# Altium schematic sheet BatteruPSU_SM-reg.SchDoc
size A4
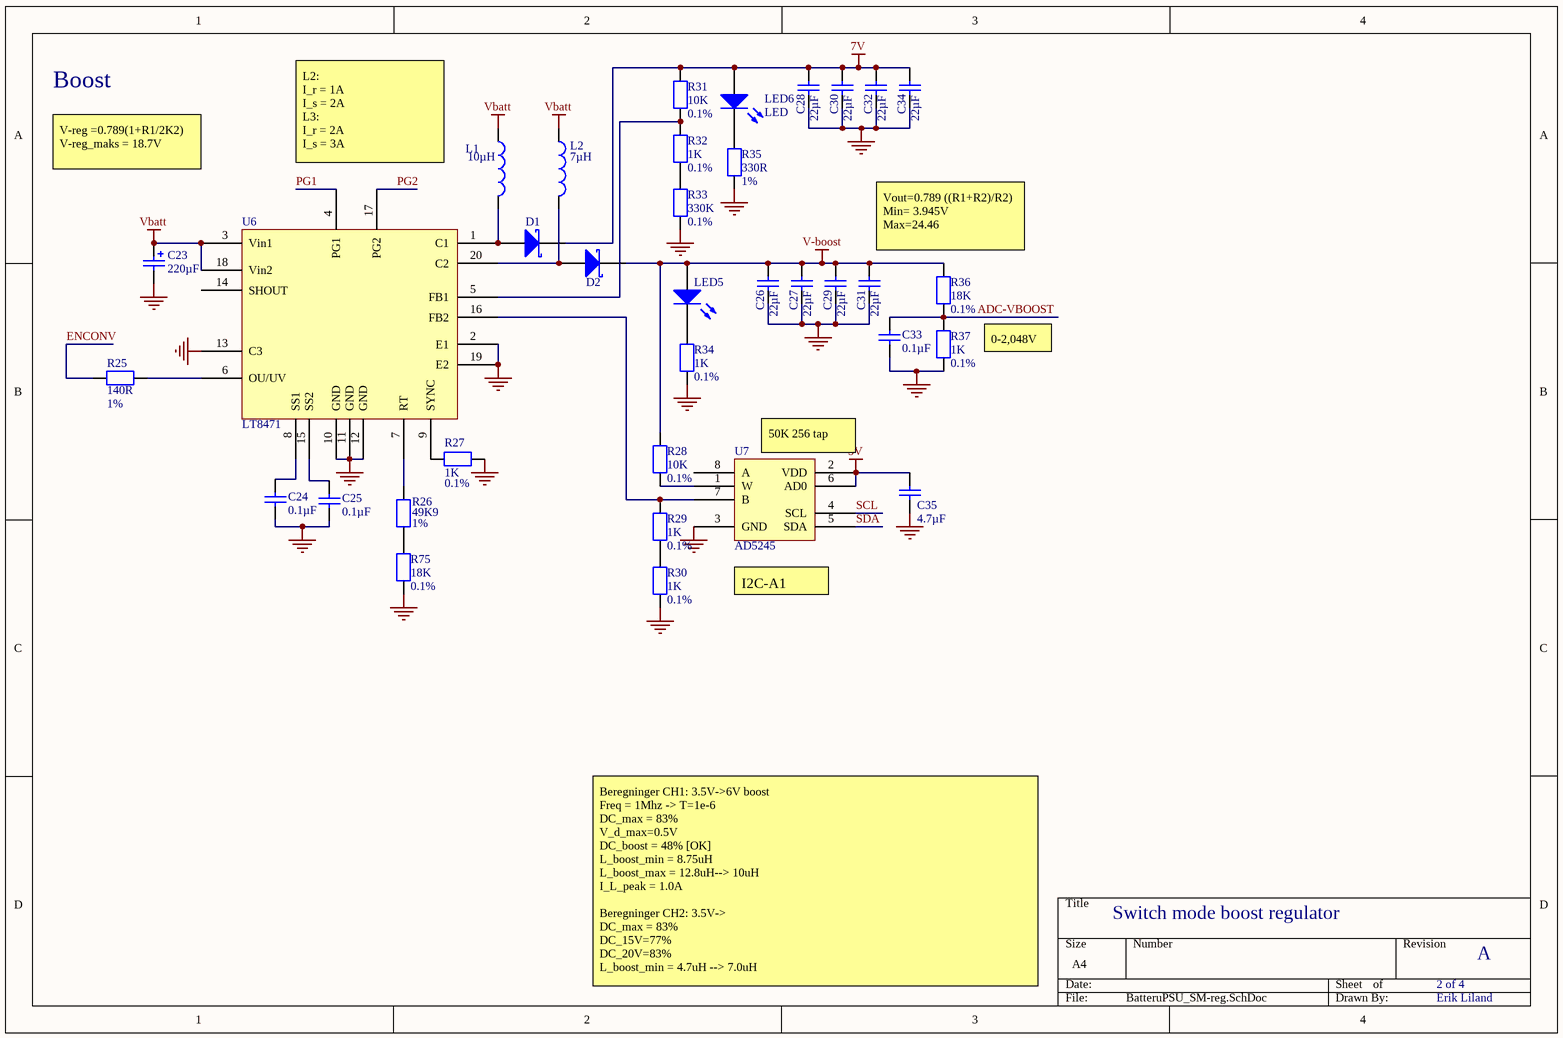
[diagram p0: BatteruPSU_SM-reg.SchDoc]

## Parts
C23  220µF  [CAP SMD (F)]
C24  0.1µF  [0805_N_CAP]
C25  0.1µF  [0805_N_CAP]
C26  22µF  [0805_N_CAP]
C27  22µF  [0805_N_CAP]
C28  22µF  [0805_N_CAP]
C29  22µF  [0805_N_CAP]
C30  22µF  [0805_N_CAP]
C31  22µF  [0805_N_CAP]
C32  22µF  [0805_N_CAP]
C33  0.1µF  [0805_N_CAP]
C34  22µF  [0805_N_CAP]
C35  4.7µF  [0805_N_CAP]
D1  D Schottky  [DO-214AC, SMA]  (value not drawn)
D2  D Schottky  [DO-214AC, SMA]  (value not drawn)
L1  Inductance: 10µH  [Inductor wirewound]  (hidden comment: Inductor)
L2  Inductance: 7µH  [Inductor wirewound]  (hidden comment: Inductor)
LED5  LED  [0805_N_LED]  (value not drawn)
LED6  LED  [0805_N_LED]
R25  140R  Tolerance: 1%  [0805_N_RES]
R26  49K9  Tolerance: 1%  [0805_N_RES]
R27  1K  Tolerance: 0.1%  [0805_N_RES]
R28  10K  Tolerance: 0.1%  [0805_N_RES]
R29  1K  Tolerance: 0.1%  [0805_N_RES]
R30  1K  Tolerance: 0.1%  [0805_N_RES]
R31  10K  Tolerance: 0.1%  [0805_N_RES]
R32  1K  Tolerance: 0.1%  [0805_N_RES]
R33  330K  Tolerance: 0.1%  [0805_N_RES]
R34  1K  Tolerance: 0.1%  [0805_N_RES]
R35  330R  Tolerance: 1%  [0805_N_RES]
R36  18K  Tolerance: 0.1%  [0805_N_RES]
R37  1K  Tolerance: 0.1%  [0805_N_RES]
R75  18K  Tolerance: 0.1%  [0805_N_RES]
U6  LT8471  [TSSOP20_N]
U7  AD5245  [SOT-23-8]

## Nets
5V: C35.1 U7.2(VDD) U7.6(AD0)
7V: C28.1 C30.1 C32.1 C34.1 D1.2(K) LED6.1(A) R31.2
GND: C23.2 C24.1 C25.1 C26.2 C27.2 C28.2 C29.2 C30.2 C31.2 C32.2 C33.1 C34.2 C35.2 R27.2 R30.1 R33.2 R34.1 R35.2 R37.2 R75.2 U6.2(E1) U6.10(GND) U6.11(GND) U6.12(GND) U6.13(C3) U6.19(E2) U7.3(GND)
V-boost: C26.1 C27.1 C29.1 C31.1 D2.2(K) LED5.1(A) R28.2 R36.1
Vbatt: C23.1 L1.1 L2.1 U6.3(Vin1) U6.18(Vin2)
ADC-VBOOST: C33.2 R36.2 R37.1
ENCONV: R25.1
PG1: U6.4(PG1)
PG2: U6.17(PG2)
SCL: U7.4(SCL)
SDA: U7.5(SDA)
NetC24_2: C24.2 U6.8(SS1)
NetC25_2: C25.2 U6.15(SS2)
NetD1_1: D1.1(A) L1.2 U6.1(C1)
NetD2_1: D2.1(A) L2.2 U6.20(C2)
NetLED5_2: LED5.2(K) R34.2
NetLED6_2: LED6.2(K) R35.1
NetR25_2: R25.2 U6.6(OU/UV)
NetR26_1: R26.1 R75.1
NetR26_2: R26.2 U6.7(RT)
NetR27_1: R27.1 U6.9(SYNC)
NetR28_1: R28.1 U7.1(W)
NetR29_1: R29.1 R30.2
NetR29_2: R29.2 U6.16(FB2) U7.7(B)
NetR31_1: R31.1 R32.2 U6.5(FB1)
NetR32_1: R32.1 R33.1

Not connected (* = marked no-connect by the designer): U6 14(SHOUT); U7 8(A)

## Notes on the sheet
- Boost
- V-reg =0.789(1+R1/2K2)
  V-reg_maks = 18.7V
- L2:
  I_r = 1A
  I_s = 2A
  L3:
  I_r = 2A
  I_s = 3A
- Vout=0.789 ((R1+R2)/R2)
  Min= 3.945V
  Max=24.46
- 0-2,048V
- (near U7) 50K 256 tap
- (near U7) I2C-A1
- Switch mode boost regulator
- Beregninger CH1: 3.5V->6V boost
  Freq = 1Mhz -> T=1e-6
  DC_max = 83%
  V_d_max=0.5V
  DC_boost = 48%	[OK]
  L_boost_min = 8.75uH
  L_boost_max = 12.8uH--> 10uH
  I_L_peak = 1.0A
  Beregninger CH2: 3.5V->
  DC_max = 83%
  DC_15V=77%
  DC_20V=83%
  L_boost_min = 4.7uH --> 7.0uH
- 2 of 4
- A
- Erik Liland

## Library data of the parts
C23 = Cap Pol: Polarized Capacitor; Manufacturer: Panasonic Electronic Components; Manufacturer Part Number: EEH-ZA1E221P; Tolerance: ±20%; ESR (Equivalent Series Resistance): 27 mOhm; Lifetime @ Temp.: 10000 Hrs @ 105°C; Type: Polymer - Hybrid; Ripple Current: 2.3A; Surface Mount Land Size: 0.327" L x 0.327" W (8.30mm x 8.30mm); Voltage - Rated: 25V; Supplier 1: Digi-Key; Supplier Part Number 1: P15437CT-ND; RoHS: RoHS Compliant; Category: Capacitors; Stock 1: 3490; Pricing 1: 1=2.68, 10=2.221, 25=2.1228, 50=2.0572, 100=1.9594, 250=1.82872 (EUR); Packaging: Cut Tape (CT); Capacitance: 220µF; Operating Temperature: -55°C ~ 105°C; Size / Dimension: 0.315" Dia (8.00mm); Height - Seated (Max): 0.413" (10.50mm); Mounting Type: Surface Mount; Package / Case: Radial, Can - SMD; ComponentLink1URL: http://industrial.panasonic.com/www-data/pdf/ABA0000/ABA0000CE136.pdf; ComponentLink1Description: http://industrial.panasonic.com/www-data/pdf/ABA0000/ABA0000CE136.pdf
C24 C25 C33 = Cap: Capacitor; Manufacturer: Kemet; Manufacturer Part Number: C0805C104K4RACTU; Temperature Coefficient: X7R; Tolerance: ±10%; Voltage - Rated: 16V; Capacitance: 0.1µF; Category: Capacitors; ComponentLink1Description: http://www.kemet.com/docfinder?Partnumber=C0805C104K4RACTU; ComponentLink1URL: http://www.kemet.com/docfinder?Partnumber=C0805C104K4RACTU; Height - Seated (Max): -; Mounting Type: Surface Mount, MLCC; Operating Temperature: -55°C ~ 125°C; Package / Case: 0805 (2012 Metric); Packaging: Cut Tape (CT); Pricing 1: 1=0.11, 10=0.076, 50=0.0436, 100=0.0359, 250=0.03024, 500=0.02534, 1000=0.02081 (EUR); RoHS: RoHS Compliant; Size / Dimension: 0.079" L x 0.049" W (2.00mm x 1.25mm); Stock 1: 286232; Supplier 1: Digi-Key; Supplier Part Number 1: 399-1167-1-ND; Thickness (Max): 0.035" (0.88mm)
C26 C27 C29 C31 = Cap: Capacitor; Manufacturer: TDK Corporation; Manufacturer Part Number: C2012X5R1V226M125AC; Tolerance: ±20%; Voltage - Rated: 35V; Temperature Coefficient: X5R; Supplier 1: Digi-Key; Supplier Part Number 1: 445-14428-1-ND; RoHS: RoHS Compliant; Category: Capacitors; Stock 1: 68492; Pricing 1: 1=1.19, 10=0.996, 100=0.6357, 250=0.52976, 500=0.47676, 1000=0.42586 (EUR); Packaging: Cut Tape (CT); Capacitance: 22µF; Mounting Type: Surface Mount, MLCC; Operating Temperature: -55°C ~ 85°C; Package / Case: 0805 (2012 Metric); Size / Dimension: 0.079" L x 0.049" W (2.00mm x 1.25mm); Height - Seated (Max): -; Thickness (Max): 0.057" (1.45mm); ComponentLink1URL: http://product.tdk.com/en/catalog/datasheets/mlcc_commercial_general_en.pdf; ComponentLink1Description: http://product.tdk.com/en/catalog/datasheets/mlcc_commercial_general_en.pdf
C28 C30 C32 C34 = Cap: Capacitor; Manufacturer: Murata Electronics North America; Manufacturer Part Number: GRM21BR61A226ME51L; Tolerance: ±20%; Voltage - Rated: 10V; Temperature Coefficient: X5R; Supplier 1: Digi-Key; Supplier Part Number 1: 490-10511-1-ND; RoHS: RoHS Compliant; Category: Capacitors; Stock 1: 429; Pricing 1: 1=0.26, 10=0.212, 25=0.1452, 50=0.119, 100=0.1056, 250=0.07924, 500=0.07, 1000=0.06207 (EUR); Packaging: Cut Tape (CT); Capacitance: 22µF; Mounting Type: Surface Mount, MLCC; Operating Temperature: -55°C ~ 85°C; Package / Case: 0805 (2012 Metric); Size / Dimension: 0.079" L x 0.049" W (2.00mm x 1.25mm); Height - Seated (Max): -; Thickness (Max): 0.055" (1.40mm); ComponentLink1URL: http://www.murata.com/~/media/webrenewal/support/library/catalog/products/capacitor/mlcc/c02e.ashx; ComponentLink1Description: http://www.murata.com/~/media/webrenewal/support/library/catalog/products/capacitor/mlcc/c02e.ashx
C35 = Cap: Capacitor; Manufacturer: Samsung Electro-Mechanics America, Inc; Manufacturer Part Number: CL21B475KOFNFNE; Tolerance: ±10%; Voltage - Rated: 16V; Temperature Coefficient: X7R; Supplier 1: Digi-Key; Supplier Part Number 1: 1276-2970-1-ND; RoHS: RoHS Compliant; Category: Capacitors; Stock 1: 58798; Pricing 1: 1=0.27, 10=0.18, 25=0.1308, 100=0.0915, 500=0.06538, 1000=0.05557 (EUR); Packaging: Cut Tape (CT); Capacitance: 4.7µF; Mounting Type: Surface Mount, MLCC; Operating Temperature: -55°C ~ 125°C; Package / Case: 0805 (2012 Metric); Size / Dimension: 0.079" L x 0.049" W (2.00mm x 1.25mm); Height - Seated (Max): -; Thickness (Max): 0.053" (1.35mm); ComponentLink1URL: http://www.samsungsem.com/kr/front/downloadcms.do?path=/kr/support/product-search/mlcc/__icsFiles/afieldfile/2014/11/05&fileName=S_CL21B475KOFNFNE.pdf; ComponentLink1Description: http://www.samsungsem.com/kr/front/downloadcms.do?path=/kr/support/product-search/mlcc/__icsFiles/afieldfile/2014/11/05&fileName=S_CL21B475KOFNFNE.pdf
D1 D2 = D Schottky: Schottky Diode; Manufacturer: Micro Commercial Co; Manufacturer Part Number: SK33A-TP; Voltage - DC Reverse (Vr) (Max): 30V; Current - Average Rectified (Io): 3A; Voltage - Forward (Vf) (Max) @ If: 500mV @ 3A; Speed: Fast Recovery =< 500ns, > 200mA (Io); Current - Reverse Leakage @ Vr: 500µA @ 30V; Capacitance @ Vr, F: 250pF @ 4V, 1MHz; Supplier 1: Digi-Key; Supplier Part Number 1: SK33A-TPCT-ND; RoHS: RoHS Compliant; Category: Discrete Semiconductor Products; Stock 1: 4384; Pricing 1: 1=0.57, 10=0.403, 25=0.3316, 100=0.2649, 250=0.19304, 500=0.15676, 1000=0.1205 (EUR); Packaging: Cut Tape (CT); Diode Type: Schottky; Reverse Recovery Time (trr): -; Mounting Type: Surface Mount; Package / Case: DO-214AC, SMA; Supplier Device Package: DO-214AC (HSMA); Operating Temperature - Junction: -50°C ~ 125°C; ComponentLink1URL: http://www.mccsemi.com/up_pdf/SK32A-SK310A(HSMA).PDF; ComponentLink1Description: http://www.mccsemi.com/up_pdf/SK32A-SK310A(HSMA).PDF; Published: 8-Jun-2000; LatestRevisionDate: 17-Jul-2002; LatestRevisionNote: Re-released for DXP Platform.; PackageReference: SMB; Publisher: Altium Limited; PackageDescription: DO-214-AA/SMB; 2 C-Bend Leads; Body 5.3 x 3.6 mm, inc. leads (LxW); Code_JEDEC: DO-214-AA
L1 = Inductor: Manufacturer: Bourns Inc.; Manufacturer Part Number: SRR1005-100M; Value: 11uH; Type: Wirewound; Material - Core: Ferrite; Tolerance: ±20%; Current Rating: 2A; Current - Saturation: 3A; Shielding: Shielded; DC Resistance (DCR): 65 mOhm Max; Q @ Freq: 48 @ 2.52MHz; Frequency - Self Resonant: 30MHz; Frequency - Test: 1kHz; Supplier 1: Digi-Key; Supplier Part Number 1: SRR1005-100MCT-ND; RoHS: RoHS Compliant; Category: Inductors, Coils, Chokes; Stock 1: 2322; Pricing 1: 1=0.91, 10=0.854, 25=0.798, 50=0.6838, 100=0.6496, 250=0.59264 (EUR); Packaging: Cut Tape (CT); Operating Temperature: -40°C ~ 125°C; Mounting Type: Surface Mount; Package / Case: Nonstandard; Size / Dimension: 0.500" L x 0.394" W (12.70mm x 10.00mm); Height - Seated (Max): 0.205" (5.20mm); Supplier Device Package: -; ComponentLink1URL: http://www.bourns.com/data/global/pdfs/SRR1005.pdf; ComponentLink1Description: http://www.bourns.com/data/global/pdfs/SRR1005.pdf
L2 = Inductor: Manufacturer: Bourns Inc.; Manufacturer Part Number: SRR1005-7R0M; Type: Wirewound; Material - Core: Ferrite; Tolerance: ±20%; Current Rating: 2.2A; Current - Saturation: 3.2A; Shielding: Shielded; DC Resistance (DCR): 55 mOhm Max; Q @ Freq: 22 @ 7.96MHz; Frequency - Self Resonant: 32MHz; Frequency - Test: 1kHz; Supplier 1: Digi-Key; Supplier Part Number 1: SRR1005-7R0MCT-ND; RoHS: RoHS Compliant; Category: Inductors, Coils, Chokes; Stock 1: 0; Pricing 1: 1=0 (EUR); Packaging: Cut Tape (CT); Operating Temperature: -40°C ~ 125°C; Mounting Type: Surface Mount; Package / Case: Nonstandard; Size / Dimension: 0.500" L x 0.394" W (12.70mm x 10.00mm); Height - Seated (Max): 0.205" (5.20mm); Supplier Device Package: -; ComponentLink1URL: http://www.bourns.com/data/global/pdfs/SRR1005.pdf; ComponentLink1Description: http://www.bourns.com/data/global/pdfs/SRR1005.pdf
LED5 LED6 = LED: Typical RED, GREEN, YELLOW, AMBER; Manufacturer: OSRAM Opto Semiconductors Inc; Manufacturer Part Number: LG R971-KN-1; Wavelength - Dominant: 570nm; Wavelength - Peak: 572nm; Millicandela Rating: 26.05mcd; Voltage - Forward (Vf) (Typ): 2.2V; Current - Test: 20mA; Viewing Angle: 160°; Lens Style/Size: Rectangle with Flat Top, 1.30mm x 1.25mm; Lens Transparency: Diffused; Lens Color: White; Supplier 1: Digi-Key; Supplier Part Number 1: 475-1410-1-ND; RoHS: RoHS Compliant; Category: Optoelectronics; Stock 1: 152991; Pricing 1: 1=0.1, 10=0.087, 100=0.0691, 250=0.06048, 500=0.05526 (EUR); Packaging: Cut Tape (CT); Color: Green; Package / Case: 0805 (2012 Metric); Size / Dimension: 2.00mm L x 1.25mm W; Mounting Type: Surface Mount; ComponentLink1URL: http://www.osram-os.com/Graphics/XPic9/00078860_0.pdf; ComponentLink1Description: http://www.osram-os.com/Graphics/XPic9/00078860_0.pdf; Supplier Device Package: *; Height (Max): 0.90mm
R25 = Res: Resistor; Manufacturer: Samsung Electro-Mechanics America, Inc; Manufacturer Part Number: RC2012F1400CS; Power (Watts): 0.125W, 1/8W; Resistance (Ohms): 140; Temperature Coefficient: ±100ppm/°C; Value: 140R; Category: Resistors; ComponentLink1Description: http://www.samsungsem.com/global/support/library/product-catalog/__icsFiles/afieldfile/2015/01/12/CHIP_RESISTOR_150112_1.pdf; ComponentLink1URL: http://www.samsungsem.com/global/support/library/product-catalog/__icsFiles/afieldfile/2015/01/12/CHIP_RESISTOR_150112_1.pdf; Composition: Thick Film; Height: 0.024" (0.60mm); Number of Terminations: 2; Operating Temperature: -55°C ~ 155°C; Package / Case: 0805 (2012 Metric); Packaging: Cut Tape (CT); Pricing 1: 1=0.1, 10=0.022, 25=0.016, 100=0.0092, 500=0.00558, 1000=0.00411, 2500=0.00358 (EUR); RoHS: RoHS Compliant; Size / Dimension: 0.079" L x 0.049" W (2.00mm x 1.25mm); Stock 1: 7060; Supplier 1: Digi-Key; Supplier Device Package: 0805 (2012 Metric); Supplier Part Number 1: 1276-5229-1-ND
R26 = Res: Resistor; Manufacturer: Samsung Electro-Mechanics America, Inc; Manufacturer Part Number: RC2012F4992CS; Resistance (Ohms): 49.9k; Power (Watts): 0.125W, 1/8W; Temperature Coefficient: ±100ppm/°C; Value: 49K9; Supplier 1: Digi-Key; Supplier Part Number 1: 1276-5378-1-ND; RoHS: RoHS Compliant; Category: Resistors; Stock 1: 1527; Pricing 1: 1=0.1, 10=0.022, 25=0.016, 100=0.0092, 500=0.00558, 1000=0.00411, 2500=0.00358 (EUR); Packaging: Cut Tape (CT); Composition: Thick Film; Operating Temperature: -55°C ~ 155°C; Package / Case: 0805 (2012 Metric); Supplier Device Package: 0805 (2012 Metric); Size / Dimension: 0.079" L x 0.049" W (2.00mm x 1.25mm); Height: 0.024" (0.60mm); Number of Terminations: 2; ComponentLink1URL: http://www.samsungsem.com/global/support/library/product-catalog/__icsFiles/afieldfile/2015/01/12/CHIP_RESISTOR_150112_1.pdf; ComponentLink1Description: http://www.samsungsem.com/global/support/library/product-catalog/__icsFiles/afieldfile/2015/01/12/CHIP_RESISTOR_150112_1.pdf
R27 R29 R30 R32 R34 R37 = Res: Resistor; Manufacturer: Panasonic Electronic Components; Manufacturer Part Number: ERA-6AEB102V; Power (Watts): 0.125W, 1/8W; Temperature Coefficient: ±25ppm/°C; Value: 1K; Category: Resistors; ComponentLink1Description: http://industrial.panasonic.com/www-cgi/jvcr13pz.cgi?E+PZ+3+AOA0026+ERA6AEB102V+7+WW; ComponentLink1URL: http://industrial.panasonic.com/www-cgi/jvcr13pz.cgi?E+PZ+3+AOA0026+ERA6AEB102V+7+WW; Composition: Thin Film; Height: 0.024" (0.60mm); Number of Terminations: 2; Operating Temperature: -55°C ~ 155°C; Package / Case: 0805 (2012 Metric); Packaging: Cut Tape (CT); Pricing 1: 1=0.64, 50=0.2516, 100=0.194, 250=0.15092, 500=0.10636, 1000=0.07761 (EUR); Resistance (Ohms): 1k; RoHS: RoHS Compliant; Size / Dimension: 0.079" L x 0.049" W (2.00mm x 1.25mm); Stock 1: 142110; Supplier 1: Digi-Key; Supplier Device Package: 0805; Supplier Part Number 1: P1.0KDACT-ND
R28 R31 = Res: Resistor; Manufacturer: TE Connectivity AMP Connectors; Manufacturer Part Number: 8-1614884-4; Power (Watts): 0.1W, 1/10W; Temperature Coefficient: ±25ppm/°C; Value: 10K; Category: Resistors; ComponentLink1Description: http://www.te.com/commerce/DocumentDelivery/DDEController?Action=srchrtrv&DocNm=1773200&DocType=DS&DocLang=English; ComponentLink1URL: http://www.te.com/commerce/DocumentDelivery/DDEController?Action=srchrtrv&DocNm=1773200&DocType=DS&DocLang=English; Composition: Thin Film; Height: 0.026" (0.65mm); Number of Terminations: 2; Operating Temperature: -55°C ~ 155°C; Package / Case: 0805 (2012 Metric); Packaging: Cut Tape (CT); Pricing 1: 1=0.18, 100=0.1714, 500=0.16136 (EUR); Resistance (Ohms): 10k; RoHS: RoHS Compliant; Size / Dimension: 0.079" L x 0.049" W (2.00mm x 1.25mm); Stock 1: 18690; Supplier 1: Digi-Key; Supplier Device Package: 0805; Supplier Part Number 1: A103142CT-ND
R33 = Res: Resistor; Manufacturer: TE Connectivity AMP Connectors; Manufacturer Part Number: 8-1614884-4; Value: 10K; Power (Watts): 0.1W, 1/10W; Temperature Coefficient: ±25ppm/°C; Category: Resistors; ComponentLink1Description: http://www.te.com/commerce/DocumentDelivery/DDEController?Action=srchrtrv&DocNm=1773200&DocType=DS&DocLang=English; ComponentLink1URL: http://www.te.com/commerce/DocumentDelivery/DDEController?Action=srchrtrv&DocNm=1773200&DocType=DS&DocLang=English; Composition: Thin Film; Height: 0.026" (0.65mm); Number of Terminations: 2; Operating Temperature: -55°C ~ 155°C; Package / Case: 0805 (2012 Metric); Packaging: Cut Tape (CT); Pricing 1: 1=0.18, 100=0.1714, 500=0.16136 (EUR); Resistance (Ohms): 10k; RoHS: RoHS Compliant; Size / Dimension: 0.079" L x 0.049" W (2.00mm x 1.25mm); Stock 1: 18690; Supplier 1: Digi-Key; Supplier Device Package: 0805; Supplier Part Number 1: A103142CT-ND
R35 = Res: Resistor; Manufacturer: Samsung Electro-Mechanics America, Inc; Manufacturer Part Number: RC2012F1400CS; Value: 140R; Power (Watts): 0.125W, 1/8W; Resistance (Ohms): 140; Temperature Coefficient: ±100ppm/°C; Category: Resistors; ComponentLink1Description: http://www.samsungsem.com/global/support/library/product-catalog/__icsFiles/afieldfile/2015/01/12/CHIP_RESISTOR_150112_1.pdf; ComponentLink1URL: http://www.samsungsem.com/global/support/library/product-catalog/__icsFiles/afieldfile/2015/01/12/CHIP_RESISTOR_150112_1.pdf; Composition: Thick Film; Height: 0.024" (0.60mm); Number of Terminations: 2; Operating Temperature: -55°C ~ 155°C; Package / Case: 0805 (2012 Metric); Packaging: Cut Tape (CT); Pricing 1: 1=0.1, 10=0.022, 25=0.016, 100=0.0092, 500=0.00558, 1000=0.00411, 2500=0.00358 (EUR); RoHS: RoHS Compliant; Size / Dimension: 0.079" L x 0.049" W (2.00mm x 1.25mm); Stock 1: 7060; Supplier 1: Digi-Key; Supplier Device Package: 0805 (2012 Metric); Supplier Part Number 1: 1276-5229-1-ND
R36 R75 = Res: Resistor; Manufacturer: Panasonic Electronic Components; Manufacturer Part Number: ERA-6AEB183V; Power (Watts): 0.125W, 1/8W; Temperature Coefficient: ±25ppm/°C; Value: 18K; Category: Resistors; ComponentLink1Description: http://industrial.panasonic.com/www-cgi/jvcr13pz.cgi?E+PZ+3+AOA0026+ERA6AEB183V+7+WW; ComponentLink1URL: http://industrial.panasonic.com/www-cgi/jvcr13pz.cgi?E+PZ+3+AOA0026+ERA6AEB183V+7+WW; Composition: Thin Film; Height: 0.024" (0.60mm); Number of Terminations: 2; Operating Temperature: -55°C ~ 155°C; Package / Case: 0805 (2012 Metric); Packaging: Cut Tape (CT); Pricing 1: 1=0.64, 50=0.2516, 100=0.194, 250=0.15092, 500=0.10636, 1000=0.07761 (EUR); Resistance (Ohms): 18k; RoHS: RoHS Compliant; Size / Dimension: 0.079" L x 0.049" W (2.00mm x 1.25mm); Stock 1: 21371; Supplier 1: Digi-Key; Supplier Device Package: 0805; Supplier Part Number 1: P18KDACT-ND
U6 = LT8471: DC/DC conv; Manufacturer: Linear Technology; Manufacturer Part Number: LT8471IFE#PBF; Output Type: Adjustable; Number of Outputs: 2; Frequency - Switching: 100kHz ~ 2MHz; Current - Output: 1.35A (Switch), 2.1A (Switch); Synchronous Rectifier: No; Function: Step-Up, Step-Down, Step-Up/Step-Down; Output Configuration: Positive or Negative; Topology: Buck, Boost, Flyback, SEPIC; Voltage - Input (Min): 2.6V; Voltage - Input (Max): 50V; Voltage - Output (Max): 50V (Switch); Supplier 1: Digi-Key; Supplier Part Number 1: LT8471IFE#PBF-ND; RoHS: RoHS Compliant; Category: Integrated Circuits (ICs); Stock 1: 132; Pricing 1: 1=9.39, 25=6.2776, 100=5.3412 (EUR); Packaging: Tube; Operating Temperature: -40°C ~ 125°C (TJ); Mounting Type: Surface Mount; Package / Case: 20-TSSOP (0.173", 4.40mm Width) Exposed Pad; Supplier Device Package: 20-TSSOP; ComponentLink1URL: http://www.linear.com/docs/44404; ComponentLink1Description: http://www.linear.com/docs/44404; Voltage - Output (Min/Fixed): 2.6V
U7 = AD5245: DigPot; Manufacturer: Analog Devices Inc; Manufacturer Part Number: AD5245BRJZ50-RL7; Configuration: Potentiometer; Number of Circuits: 1; Number of Taps: 256; Resistance (Ohms): 50k; Interface: I²C; Memory Type: Volatile; Voltage - Supply: 2.7 V ~ 5.5 V; Tolerance: ±30%; Temperature Coefficient (Typ): 45 ppm/°C; Resistance - Wiper (Ohms) (Typ): 50; Supplier 1: Digi-Key; Supplier Part Number 1: AD5245BRJZ50-RL7CT-ND; RoHS: RoHS Compliant; Stock 1: 2986; Pricing 1: 1=1.96, 10=1.766, 25=1.582, 100=1.4226, 250=1.26316, 500=1.10372, 1000=0.91364 (EUR); Packaging: Cut Tape (CT); ComponentLink1URL: http://www.analog.com/media/en/technical-documentation/data-sheets/AD5245.pdf; ComponentLink1Description: http://www.analog.com/media/en/technical-documentation/data-sheets/AD5245.pdf; Category: Integrated Circuits (ICs); Taper: Linear; Features: Selectable Address; Operating Temperature: -40°C ~ 125°C; Package / Case: SOT-23-8; Supplier Device Package: SOT-23-8